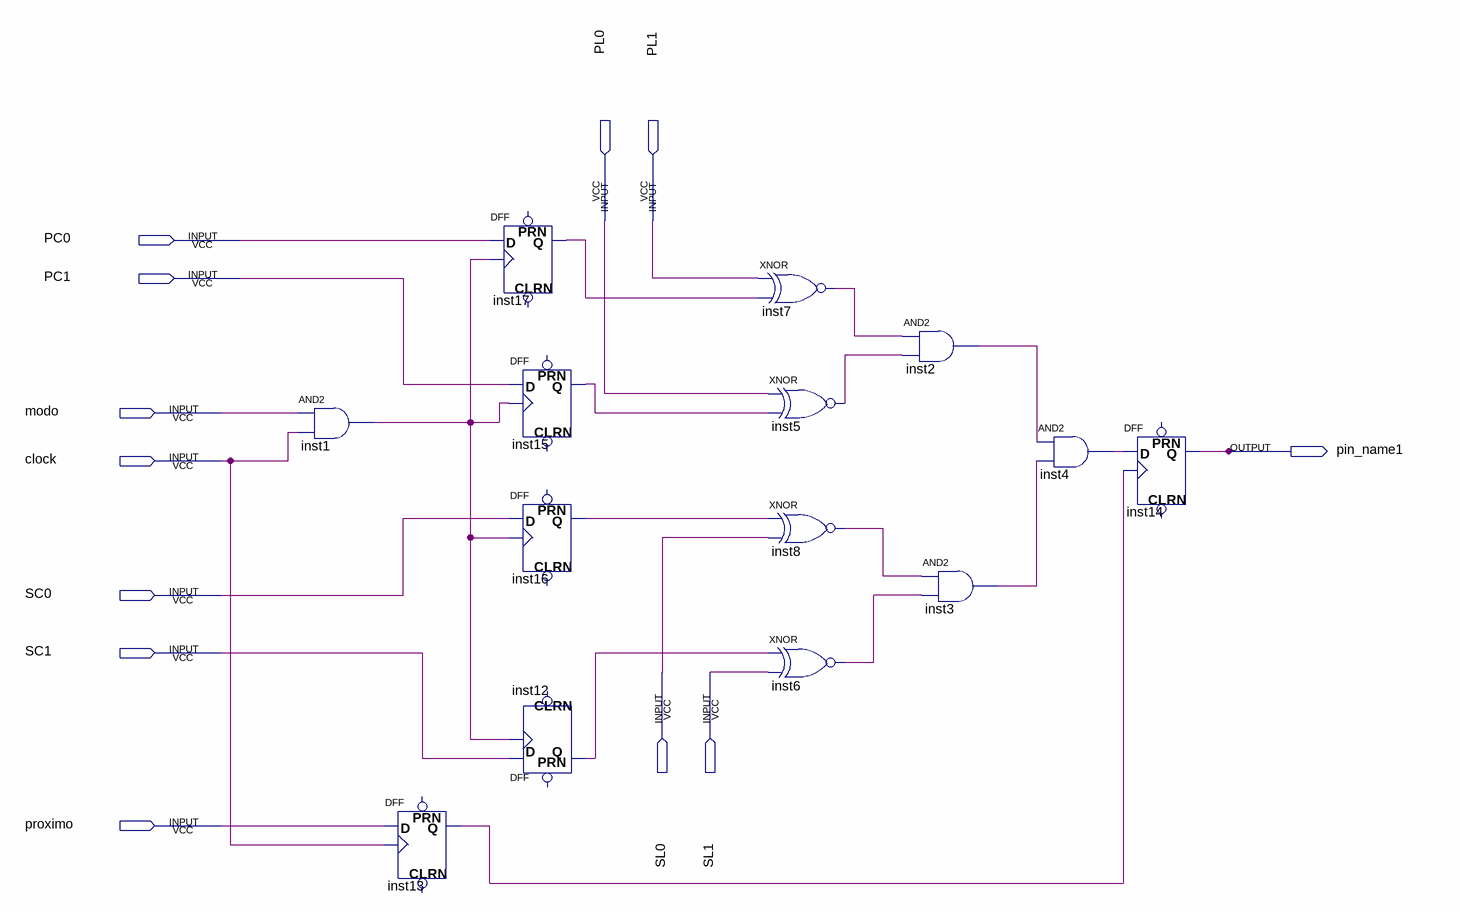
[diagram p0: schematic sheet]
// Quartus schematic fluxo_de_dados.bdf as structural Verilog: 14 symbols, 12 pins
module fluxo_de_dados (
  input  PL0,
  input  PL1,
  input  PC0,
  input  PC1,
  input  modo,
  input  clock,
  input  SC0,
  input  SC1,
  input  SL0,
  input  SL1,
  input  proximo,
  output pin_name1
);

  wire inst1_out, inst2_out, inst3_out, inst4_out, inst5_out, inst6_out, inst7_out, inst8_out, inst12_q,
       inst13_q, inst15_q, inst16_q, inst17_q;

  and inst1 (inst1_out, modo, clock);
  DFF inst13 (.CLK(clock), .D(proximo), .Q(inst13_q));  // open: CLRN, PRN
  DFF inst17 (.CLK(inst1_out), .D(PC0), .Q(inst17_q));  // open: CLRN, PRN
  DFF inst15 (.CLK(inst1_out), .D(PC1), .Q(inst15_q));  // open: CLRN, PRN
  DFF inst16 (.CLK(inst1_out), .D(SC0), .Q(inst16_q));  // open: CLRN, PRN
  DFF inst12 (.CLK(inst1_out), .D(SC1), .Q(inst12_q));  // open: CLRN, PRN
  xnor inst7 (inst7_out, PL1, inst17_q);
  xnor inst5 (inst5_out, PL0, inst15_q);
  xnor inst8 (inst8_out, inst16_q, SL0);
  xnor inst6 (inst6_out, inst12_q, SL1);
  and inst2 (inst2_out, inst7_out, inst5_out);
  and inst3 (inst3_out, inst8_out, inst6_out);
  and inst4 (inst4_out, inst2_out, inst3_out);
  DFF inst14 (.CLK(inst13_q), .D(inst4_out), .Q(pin_name1));  // open: CLRN, PRN
endmodule
